# EAGLE design mb2 (EAGLE 7.4.0)
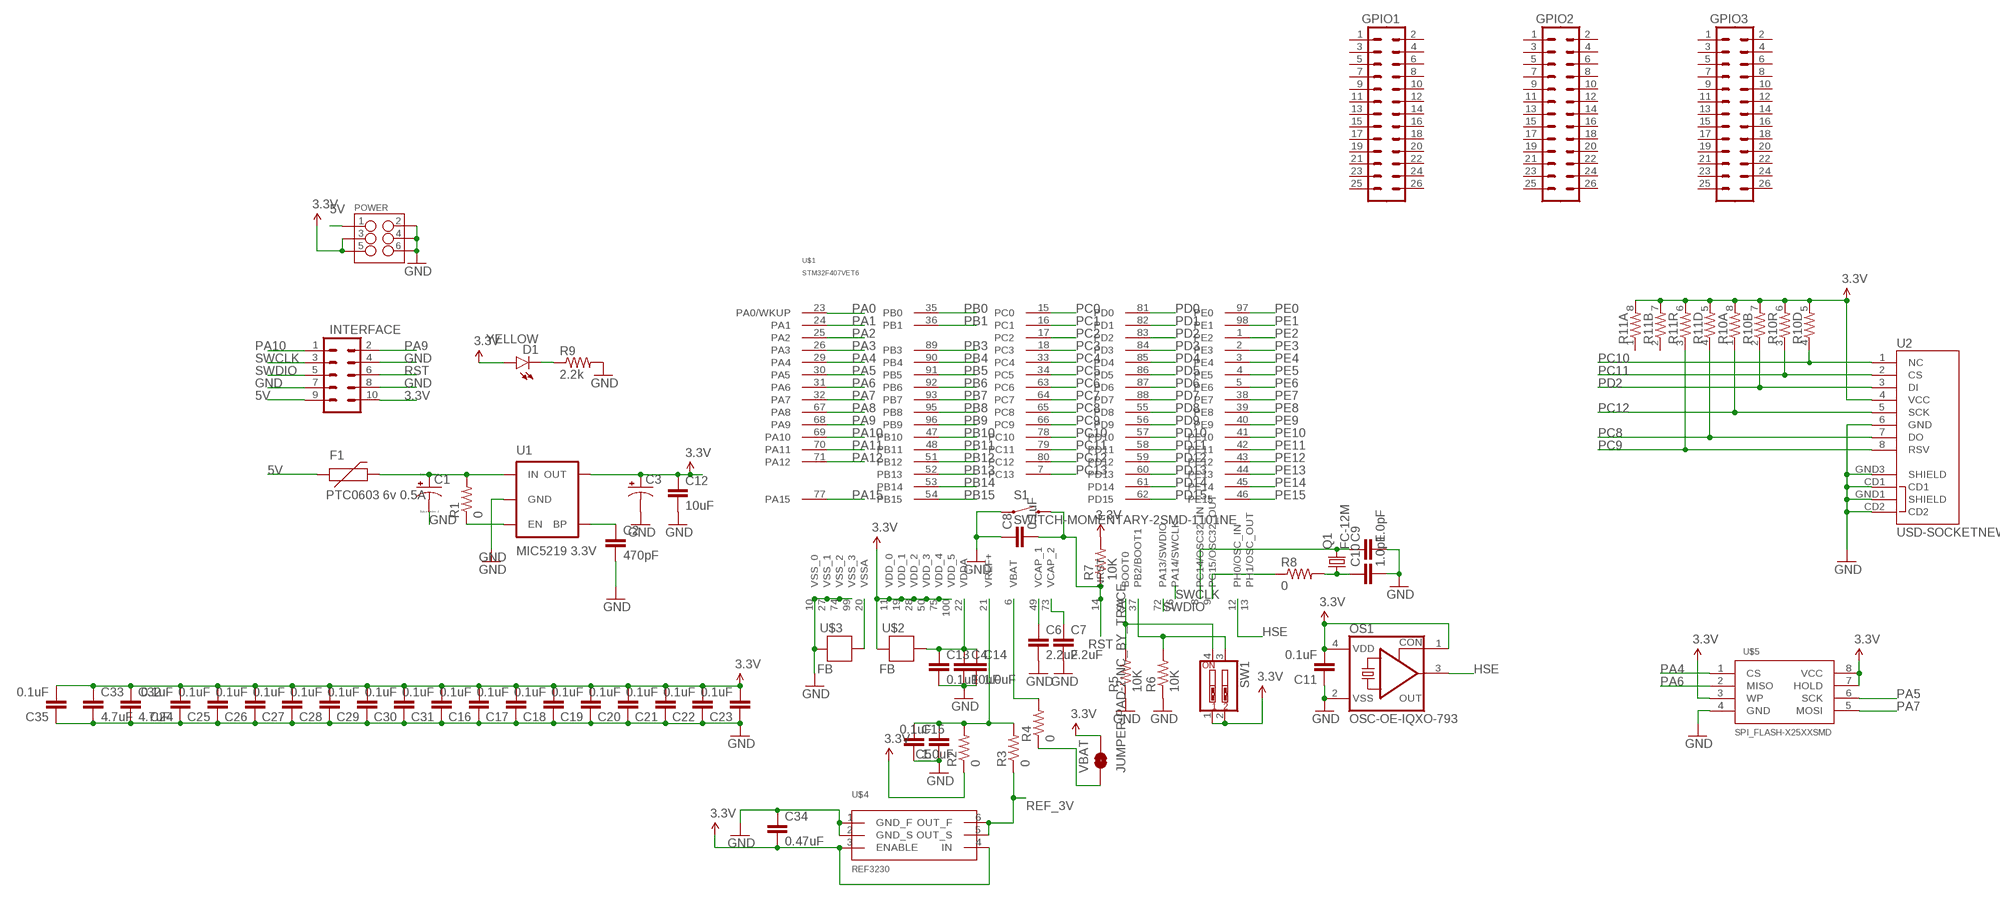
[diagram p0: schematic, sheet 1]

## Parts
C1  CPOL-USB  [PANASONIC_B]
C2  470pF  470PF-50V-5%(0603)SMD  [0603-CAP]
C3  CAP_POL1206  [EIA3216]
C4  10uF  10UF-6.3V-20%(0603)  [0603-CAP]
C5  0.1uF  0.1UF-25V-5%(0603)  [0603-CAP]
C6  2.2uF  2.2UF-10V-20%(0603)  [0603-CAP]
C7  2.2uF  2.2UF-10V-20%(0603)  [0603-CAP]
C8  0.1uF  0.1UF-25V-5%(0603)  [0603-CAP]
C9  1.0pF  1.0PF-50V(-/+.25PF)(0603)  [0603-CAP]
C10  1.0pF  1.0PF-50V(-/+.25PF)(0603)  [0603-CAP]
C11  0.1uF  0.1UF-25V-5%(0603)  [0603-CAP]
C12  10uF  10UF-6.3V-20%(0603)  [0603-CAP]
C13  0.1uF  0.1UF-25V-5%(0603)  [0603-CAP]
C14  1.0uF  1.0UF-16V-10%(0603)  [0603-CAP]
C15  1.0uF  1.0UF-16V-10%(0603)  [0603-CAP]
C16  0.1uF  0.1UF-25V-5%(0603)  [0603-CAP]
C17  0.1uF  0.1UF-25V-5%(0603)  [0603-CAP]
C18  0.1uF  0.1UF-25V-5%(0603)  [0603-CAP]
C19  0.1uF  0.1UF-25V-5%(0603)  [0603-CAP]
C20  0.1uF  0.1UF-25V-5%(0603)  [0603-CAP]
C21  0.1uF  0.1UF-25V-5%(0603)  [0603-CAP]
C22  0.1uF  0.1UF-25V-5%(0603)  [0603-CAP]
C23  0.1uF  0.1UF-25V-5%(0603)  [0603-CAP]
C24  0.1uF  0.1UF-25V-5%(0603)  [0603-CAP]
C25  0.1uF  0.1UF-25V-5%(0603)  [0603-CAP]
C26  0.1uF  0.1UF-25V-5%(0603)  [0603-CAP]
C27  0.1uF  0.1UF-25V-5%(0603)  [0603-CAP]
C28  0.1uF  0.1UF-25V-5%(0603)  [0603-CAP]
C29  0.1uF  0.1UF-25V-5%(0603)  [0603-CAP]
C30  0.1uF  0.1UF-25V-5%(0603)  [0603-CAP]
C31  0.1uF  0.1UF-25V-5%(0603)  [0603-CAP]
C32  4.7uF  4.7UF-6.3V-10%(0603)0603  [0603-CAP]
C33  4.7uF  4.7UF-6.3V-10%(0603)0603  [0603-CAP]
C34  0.47uF  0.1UF-25V-5%(0603)  [0603-CAP]
C35  0.1uF  0.1UF-25V-5%(0603)  [0603-CAP]
D1  YELLOW  LED-YELLOW1206  [LED-1206]
F1  PTC0603 6v 0.5A  PTC0603  [0603]
GPIO1  M13X22X13  [2X13]
GPIO2  M13X22X13  [2X13]
GPIO3  M13X22X13  [2X13]
INTERFACE  M05X2RA  [2X5-RA]
OS1  OSC-OE-IQXO-793  [2.5X2-4-PAD]
POWER  M03X22X3_SILK_MALE_PTH  [2X3]
Q1  FC-12M  [FC-12M]
R1  0  0OHM-1/10W-5%(0603)  [0603]
R2  0  0OHM-1/10W-5%(0603)  [0603]
R3  0  0OHM-1/10W-5%(0603)  [0603]
R4  0  0OHM-1/10W-5%(0603)  [0603]
R5  10K  10KOHM-1/10W-1%(0603)0603  [0603-RES]
R6  10K  10KOHM-1/10W-1%(0603)0603  [0603-RES]
R7  10K  10KOHM-1/10W-1%(0603)0603  [0603-RES]
R8  0  0OHM-1/10W-5%(0603)  [0603]
R9  2.2k  2.2KOHM-1/10W-1%(0603)  [0603-RES]
R10  RESISTOR-ARRAY0603-ARV  [0603-ARV]
R11  RESISTOR-ARRAY0603-ARV  [0603-ARV]
S1  SWITCH-MOMENTARY-2SMD-1101NE  [TACTILE-SWITCH-1101NE]
SW1  SW_DIP-2-SMT-HALFSIZE  [DIPSWITCH-02-50MIL]
U1  MIC5219 3.3V  V_REG_MIC52193.3V  [SOT23-5]
U2  USD-SOCKETNEW  [MICRO-SD-SOCKET-PP]
U$1  STM32F407VET6  [LQFP-100]
U$2  FB  [0603]
U$3  FB  [0603]
U$4  REF3230  [SOT23-6]
U$5  SPI_FLASH-X25XXSMD  [SO08]
VBAT  JUMPER-PAD-2-NC_BY_TRACE  [PAD-JUMPER-2-NC_BY_TRACE_YES_SILK]

## Nets
3.3V: C3.A(+) C11.2 C12.1 C16.2 C17.2 C18.2 C19.2 C20.2 C21.2 C22.2 C23.2 C24.2 C25.2 C26.2 C27.2 C28.2 C29.2 C30.2 C31.2 C32.1 C33.1 C34.2 C35.2 D1.A INTERFACE.10 OS1.1(CON) OS1.4(VDD) POWER.3 POWER.5 R2.1 R7.2 R10.5 R10.6 R10.7 R10.8 R11.5 R11.6 R11.7 R11.8 SW1.1 SW1.2 U1.5(OUT) U2.4(VCC) U$1.11(VDD_0) U$1.19(VDD_1) U$1.28(VDD_2) U$1.50(VDD_3) U$1.75(VDD_4) U$1.100(VDD_5) U$2.2 U$4.3(ENABLE) U$4.4(IN) U$5.3(WP) U$5.7(HOLD) U$5.8(VCC) VBAT.2
5V: F1.1 INTERFACE.9 POWER.1
GND: C1.- C2.2 C3.C(-) C4.2 C5.1 C6.2 C7.2 C8.1 C9.2 C10.2 C11.1 C12.2 C13.2 C14.2 C15.2 C16.1 C17.1 C18.1 C19.1 C20.1 C21.1 C22.1 C23.1 C24.1 C25.1 C26.1 C27.1 C28.1 C29.1 C30.1 C31.1 C32.2 C33.2 C34.1 C35.1 INTERFACE.4 INTERFACE.7 INTERFACE.8 OS1.2(VSS) POWER.2 POWER.4 POWER.6 R5.1 R6.1 R9.2 S1.1 U1.2(GND) U2.6(GND) U2.CD1 U2.CD2 U2.GND1(SHIELD) U2.GND3(SHIELD) U$1.10(VSS_0) U$1.27(VSS_1) U$1.74(VSS_2) U$1.99(VSS_3) U$3.2 U$4.1(GND_F) U$4.2(GND_S) U$5.4(GND)
HSE: OS1.3(OUT) U$1.12(PH0/OSC_IN)
N$1: C1.+ F1.2 R1.2 U1.1(IN)
N$2: R1.1 U1.3(EN)
N$3: C2.1 U1.4(BP)
N$4: U$1.20(VSSA) U$3.1
N$5: R4.1 VBAT.1
N$6: C4.1 C13.1 C14.1 U$1.22(VDDA) U$2.1
N$7: C5.2 C15.1 R2.2 R3.2 U$1.21(VREF+)
N$8: C6.1 U$1.49(VCAP_1)
N$9: C7.1 U$1.73(VCAP_2)
N$10: R4.2 U$1.6(VBAT)
N$11: R5.2 SW1.4 U$1.94(BOOT0)
N$12: R6.2 SW1.3 U$1.37(PB2/BOOT1)
N$13: R8.1 U$1.9(PC15/OSC32_OUT)
N$14: C10.1 Q1.1 R8.2
N$15: C9.1 Q1.2 U$1.8(PC14/OSC32_IN)
N$16: D1.C R9.1
PA0: U$1.23(PA0/WKUP)
PA1: U$1.24(PA1)
PA2: U$1.25(PA2)
PA3: U$1.26(PA3)
PA4: U$1.29(PA4) U$5.1(CS)
PA5: U$1.30(PA5) U$5.6(SCK)
PA6: U$1.31(PA6) U$5.2(MISO)
PA7: U$1.32(PA7) U$5.5(MOSI)
PA8: U$1.67(PA8)
PA9: INTERFACE.2 U$1.68(PA9)
PA10: INTERFACE.1 U$1.69(PA10)
PA11: U$1.70(PA11)
PA12: U$1.71(PA12)
PA15: U$1.77(PA15)
PB0: U$1.35(PB0)
PB1: U$1.36(PB1)
PB3: U$1.89(PB3)
PB4: U$1.90(PB4)
PB5: U$1.91(PB5)
PB6: U$1.92(PB6)
PB7: U$1.93(PB7)
PB8: U$1.95(PB8)
PB9: U$1.96(PB9)
PB10: U$1.47(PB10)
PB11: U$1.48(PB11)
PB12: U$1.51(PB12)
PB13: U$1.52(PB13)
PB14: U$1.53(PB14)
PB15: U$1.54(PB15)
PC0: U$1.15(PC0)
PC1: U$1.16(PC1)
PC2: U$1.17(PC2)
PC3: U$1.18(PC3)
PC4: U$1.33(PC4)
PC5: U$1.34(PC5)
PC6: U$1.63(PC6)
PC7: U$1.64(PC7)
PC8: R11.4 U2.7(DO) U$1.65(PC8)
PC9: R11.3 U2.8(RSV) U$1.66(PC9)
PC10: R10.4 U2.1(NC) U$1.78(PC10)
PC11: R10.3 U2.2(CS) U$1.79(PC11)
PC12: R10.1 U2.5(SCK) U$1.80(PC12)
PC13: U$1.7(PC13)
PD0: U$1.81(PD0)
PD1: U$1.82(PD1)
PD2: R10.2 U2.3(DI) U$1.83(PD2)
PD3: U$1.84(PD3)
PD4: U$1.85(PD4)
PD5: U$1.86(PD5)
PD6: U$1.87(PD6)
PD7: U$1.88(PD7)
PD8: U$1.55(PD8)
PD9: U$1.56(PD9)
PD10: U$1.57(PD10)
PD11: U$1.58(PD11)
PD12: U$1.59(PD12)
PD13: U$1.60(PD13)
PD14: U$1.61(PD14)
PD15: U$1.62(PD15)
PE0: U$1.97(PE0)
PE1: U$1.98(PE1)
PE2: U$1.1(PE2)
PE3: U$1.2(PE3)
PE4: U$1.3(PE4)
PE5: U$1.4(PE5)
PE6: U$1.5(PE6)
PE7: U$1.38(PE7)
PE8: U$1.39(PE8)
PE9: U$1.40(PE9)
PE10: U$1.41(PE10)
PE11: U$1.42(PE11)
PE12: U$1.43(PE12)
PE13: U$1.44(PE13)
PE14: U$1.45(PE14)
PE15: U$1.46(PE15)
REF_3V: R3.1 U$4.5(OUT_S) U$4.6(OUT_F)
RST: C8.2 INTERFACE.6 R7.1 S1.2 U$1.14(NRST)
SWCLK: INTERFACE.3 U$1.76(PA14/SWCLK)
SWDIO: INTERFACE.5 U$1.72(PA13/SWDIO)
Unconnected: GPIO1.1 GPIO1.2 GPIO1.3 GPIO1.4 GPIO1.5 GPIO1.6 GPIO1.7 GPIO1.8 GPIO1.9 GPIO1.10 GPIO1.11 GPIO1.12 GPIO1.13 GPIO1.14 GPIO1.15 GPIO1.16 GPIO1.17 GPIO1.18 GPIO1.19 GPIO1.20 GPIO1.21 GPIO1.22 GPIO1.23 GPIO1.24 GPIO1.25 GPIO1.26 GPIO2.1 GPIO2.2 GPIO2.3 GPIO2.4 GPIO2.5 GPIO2.6 GPIO2.7 GPIO2.8 GPIO2.9 GPIO2.10 GPIO2.11 GPIO2.12 GPIO2.13 GPIO2.14 GPIO2.15 GPIO2.16 GPIO2.17 GPIO2.18 GPIO2.19 GPIO2.20 GPIO2.21 GPIO2.22 GPIO2.23 GPIO2.24 GPIO2.25 GPIO2.26 GPIO3.1 GPIO3.2 GPIO3.3 GPIO3.4 GPIO3.5 GPIO3.6 GPIO3.7 GPIO3.8 GPIO3.9 GPIO3.10 GPIO3.11 GPIO3.12 GPIO3.13 GPIO3.14 GPIO3.15 GPIO3.16 GPIO3.17 GPIO3.18 GPIO3.19 GPIO3.20 GPIO3.21 GPIO3.22 GPIO3.23 GPIO3.24 GPIO3.25 GPIO3.26 R11.1 R11.2 U$1.13(PH1/OSC_OUT)

## Library data of the parts
C1 = resistor:CPOL-US: POLARIZED CAPACITOR, American symbol
C2 = SparkFun-Capacitors:470PF-50V-5%(0603): CAP-07884; PROD_ID: CAP-07884
C3 = SparkFun-Capacitors:CAP_POL: Capacitor Polarized These are standard SMD and PTH capacitors. Normally 10uF, 47uF, and 100uF in electrolytic and tantalum varieties. Always verify the external diameter of the through hole cap, it varies with capacity, voltage, and manufacturer. The EIA devices should be standard.
C4 C12 = SparkFun-Capacitors:10UF-6.3V-20%(0603): CAP-11015; PROD_ID: CAP-11015
C5 C8 C11 C13 C16-C31 C35 = SparkFun-Capacitors:0.1UF-25V-5%(0603): CAP-08604; PROD_ID: CAP-08604
C6 C7 = SparkFun-Capacitors:2.2UF-10V-20%(0603): CAP-07888; PROD_ID: CAP-07888
C9 C10 = SparkFun-Capacitors:1.0PF-50V(-/+.25PF)(0603): CAP-07879; PROD_ID: CAP-07879
C14 C15 = SparkFun-Capacitors:1.0UF-16V-10%(0603): CAP-00868; PROD_ID: CAP-00868
C32 C33 = SparkFun-Capacitors:4.7UF-6.3V-10%(0603): CAP-08280; PROD_ID: CAP-08280
C34 = SparkFun-Capacitors:0.1UF-25V-5%(0603): CAP-08604; PROD_ID: CAP-08604; VALUE: 0.1uF
D1 = SparkFun-LED:LED-YELLOW: Yellow SMD LEDs LilyPad 1206- DIO-09909 0603- DIO-09003 "SMART" means more efficient and expensive; PROD_ID: DIO-00820
F1 = SparkFun-PowerIC:PTC: Resettable Fuse PTC Resettable Fuse. Spark Fun Electronics SKU : COM-08357
GPIO1-GPIO3 = SparkFun-Connectors:M13X2: 0.1" spaced headers
INTERFACE = SparkFun-Connectors:M05X2: Header 5x2 Standard 10-pin dual row 0.1" header. Commonly used with AVR-ISP. Use with Spark Fun Electronics SKU: PRT-00778
OS1 = IQD-Frequency-Products:OSC-OE: OSCILLATOR WITH OE
POWER = SparkFun-Connectors:M03X2: 2x3 .1" header. Shrouded, with keying- CONN-10681 SMT- CONN-11415 Pogo pins- HW-11044; PROD_ID: CONN-09701
Q1 = crystal:FC-12M: kHz RANGE CRYSTAL UNIT LOW PROFILE SMD Source: Epson Toyocom FC-12M.pdf
R1-R4 R8 = SparkFun-Resistors:0OHM-1/10W-5%(0603): RES-08609; PROD_ID: RES-08609
R5-R7 = SparkFun-Resistors:10KOHM-1/10W-1%(0603): RES-00824; PROD_ID: RES-00824
R9 = SparkFun-Resistors:2.2KOHM-1/10W-1%(0603): RES-08272; PROD_ID: RES-08272
R10 R11 = SparkFun-Resistors:RESISTOR-ARRAY: Array Chip Resistor Source: RS Component / Phycomp
S1 = SparkFun-Electromechanical:SWITCH-MOMENTARY-2: Various NO switches- pushbuttons, reed, etc; PROD_ID: SWCH-00815
SW1 = SparkFun-Electromechanical:SW_DIP-2: DIP SWITCH
U1 = SparkFun-PowerIC:V_REG_MIC5219: V_REG MIC5219 Standard 3.3V and 5V 500mA LDO voltage regulator in SOT-23 layout. Micrel part MIC5219. BP (by-pass) pin is used to lower output noise with 470pF cap, may be left open.; PROD_ID: VREG-09872
U2 = SparkFun-Connectors:USD-SOCKET: microSD Socket Push-push type uSD socket. Schematic element and footprint production proven. Spark Fun Electronics SKU : PRT-00127. tDoc lines correctly indicate media card edge positions when inserting (unlocked, locked, depressed). NOTE: CD1 and CD2 are connected internally; PROD_ID: CONN-07820
U$1 = r1:STM32F407VET6
U$2 U$3 = SparkFun-Passives:FB
U$4 = SparkFun-AnalogIC:REF3230
U$5 = SparkFun-DigitalIC:SPI_FLASH-X25XX: 8pin SPI Flash series x25xx. Works with devices like W25X32 and BR25L32
VBAT = SparkFun-Passives:JUMPER-PAD-2-NC_BY_TRACE

## Board
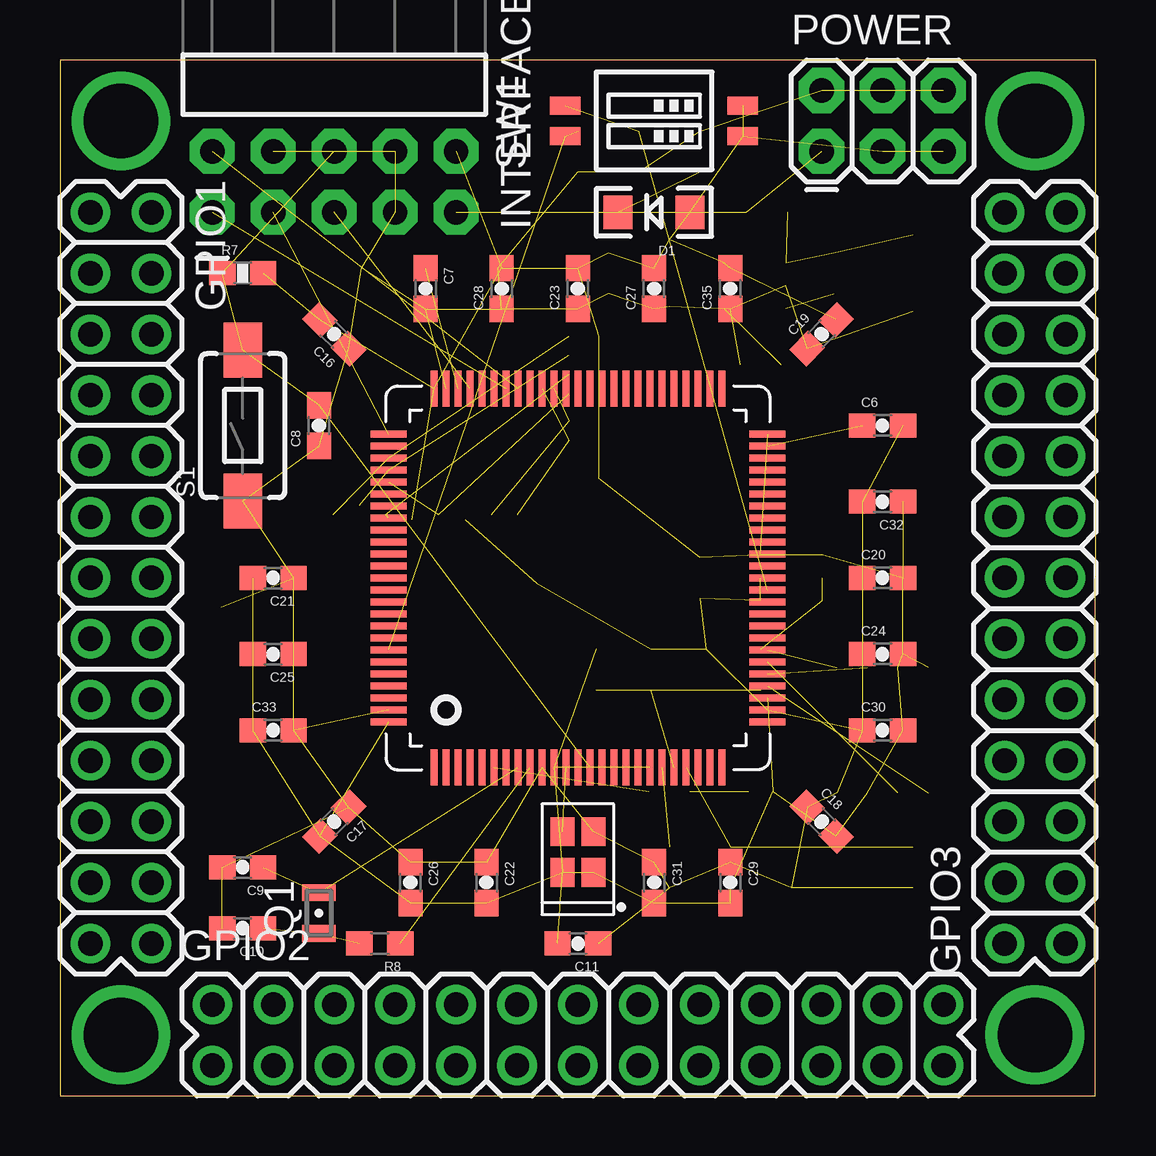
[diagram p1: board, top side]
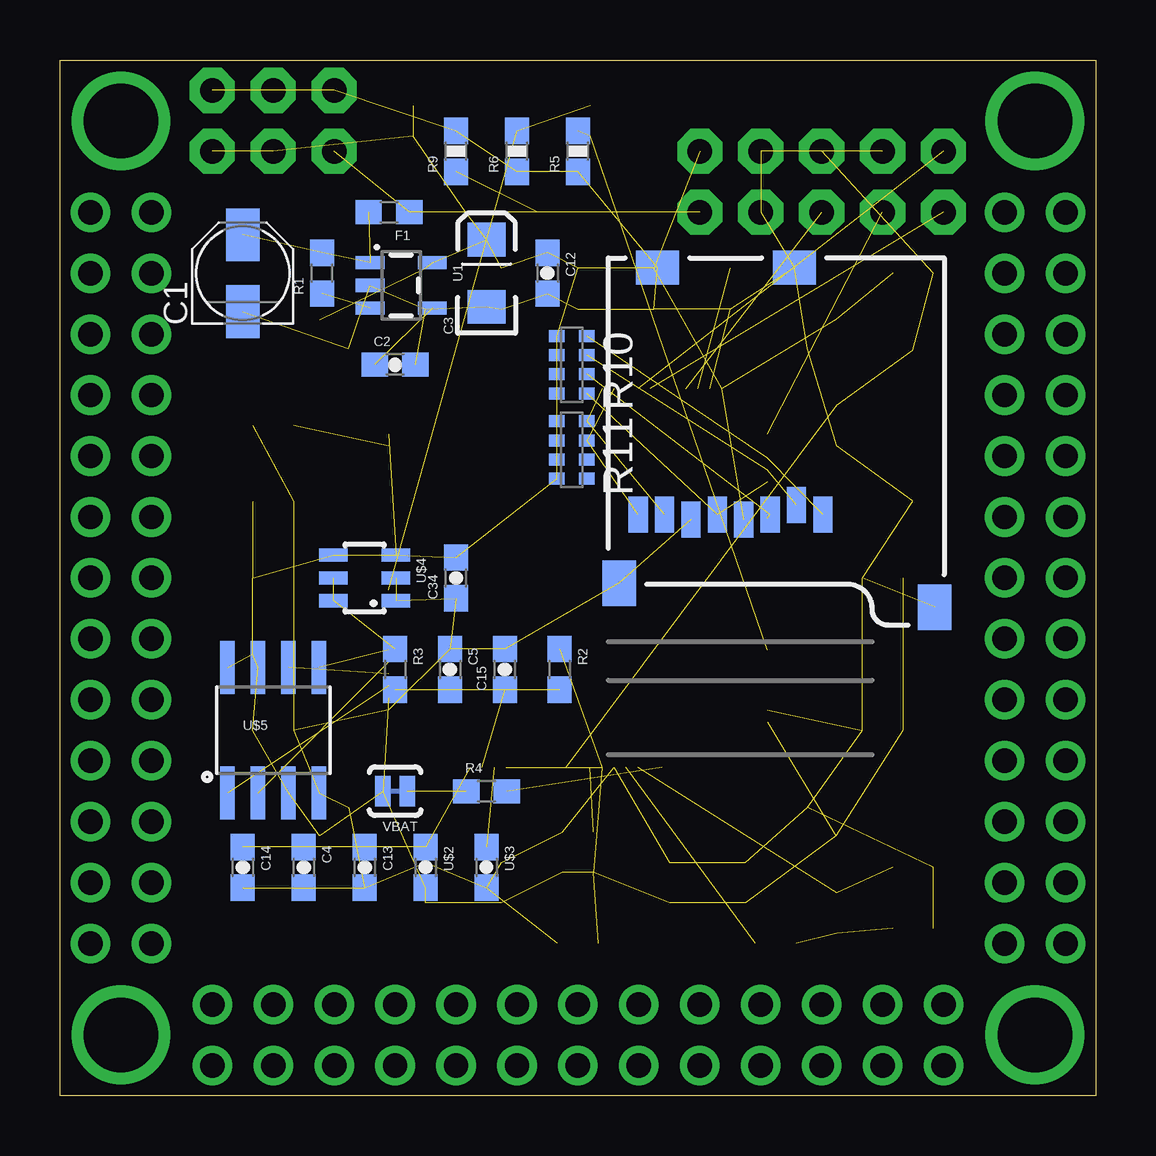
[diagram p2: board, bottom side, seen from below]

Size 43.18 x 43.18 mm. Coordinates in mm from the lower left corner, seen from the top.
Outline: 0,0 43.16,0 43.18,43.18 0,43.18 0,0
Copper layers [2:(1+(2*15)+16):15]: Top 0.035mm / dielectric 1.5mm / Route2 0.035mm / dielectric 0.15mm / Route15 0.035mm / dielectric 0.2mm / Bottom 0.035mm
Design rules "default *": minimum track width 10mil, minimum drill 24mil, track to track 8mil, track to pad 8mil, pad to pad 8mil, via to via 8mil, smd to smd 8mil, copper to edge 40mil, drill to drill 8mil, minimum pad ring 10mil, minimum via ring 8mil, stop-mask expansion 4mil, vias tented up to drill 0mil, thermal gap 10mil

### Footprints (pad centres in the part's own frame; a part is rotated, then mirrored left to right if it is on the bottom)
PANASONIC_B = smd 2.2 x 1.4: + 1.6,0; - -1.6,0
0603-CAP = smd 1.1 x 1: 1 -0.85,0; 2 0.85,0
EIA3216 = smd 1.4 x 1.6: A 1.4,0; C -1.4,0
LED-1206 = smd 1.2 x 1.4: A -1.5,0; C 1.5,0
0603 = smd 1.1 x 1: 1 -0.85,0; 2 0.85,0
2X13 = drill 1.016 pad 1.651: 1 0,0; 2 0,2.54; 3 2.54,0; 4 2.54,2.54; 5 5.08,0; 6 5.08,2.54; 7 7.62,0; 8 7.62,2.54; 9 10.16,0; 10 10.16,2.54; 11 12.7,0; 12 12.7,2.54; 13 15.24,0; 14 15.24,2.54; 15 17.78,0; 16 17.78,2.54; 17 20.32,0; 18 20.32,2.54; 19 22.86,0; 20 22.86,2.54; 21 25.4,0; 22 25.4,2.54; 23 27.94,0; 24 27.94,2.54; 25 30.48,0; 26 30.48,2.54
2X5-RA = drill 1.016 pad 1.88 octagon: 1 -1.27,5.08; 2 1.27,5.08; 3 -1.27,2.54; 4 1.27,2.54; 5 -1.27,0; 6 1.27,0; 7 -1.27,-2.54; 8 1.27,-2.54; 9 -1.27,-5.08; 10 1.27,-5.08
2.5X2-4-PAD = smd 1.2 x 1: 1 -0.85,-0.65; 2 0.85,-0.65; 3 0.85,0.65; 4 -0.85,0.65
2X3 = drill 1.016 pad 1.88 octagon: 1 0,0; 2 0,2.54; 3 2.54,0; 4 2.54,2.54; 5 5.08,0; 6 5.08,2.54
FC-12M = smd 0.7 x 1.4: 1 -0.85,0; 2 0.85,0
0603-RES = smd 1.1 x 1: 1 -0.85,0; 2 0.85,0
0603-ARV = smd 0.5 x 0.65: 1 -1.2,-0.625; 2 -0.4,-0.625; 3 0.4,-0.625; 4 1.2,-0.625; 5 1.2,0.625; 6 0.4,0.625; 7 -0.4,0.625; 8 -1.2,0.625
TACTILE-SWITCH-1101NE = smd 2.3 x 1.6: 1 -3.15,0; 2 3.15,0
DIPSWITCH-02-50MIL = smd 0.762 x 1.27: 1 -0.635,-3.7; 2 0.635,-3.7; 3 0.635,3.7; 4 -0.635,3.7
SOT23-5 = smd 0.55 x 1.2: 1 -0.95,-1.3; 2 0,-1.3; 3 0.95,-1.3; 4 0.95,1.3; 5 -0.95,1.3
MICRO-SD-SOCKET-PP = smd 0.8 x 1.5: 1 -8.94,10.7; 2 -7.84,10.3; 3 -6.74,10.7; 4 -5.64,10.9; 5 -4.54,10.7; 6 -3.44,10.9; 7 -2.34,10.7; 8 -1.24,10.7 | smd 1.8 x 1.4: CD1 -2.05,0.4; CD2 -7.75,0.4 | smd 1.4 x 1.9: GND1 -13.6,14.55; GND3 -0.45,13.55
LQFP-100 = smd 0.3 x 1.5: 1 -6,-7.9; 2 -5.5,-7.9; 3 -5,-7.9; 4 -4.5,-7.9; 5 -4,-7.9; 6 -3.5,-7.9; 7 -3,-7.9; 8 -2.5,-7.9; 9 -2,-7.9; 10 -1.5,-7.9; 11 -1,-7.9; 12 -0.5,-7.9; 13 0,-7.9; 14 0.5,-7.9; 15 1,-7.9; 16 1.5,-7.9; 17 2,-7.9; 18 2.5,-7.9; 19 3,-7.9; 20 3.5,-7.9; 21 4,-7.9; 22 4.5,-7.9; 23 5,-7.9; 24 5.5,-7.9; 25 6,-7.9; 51 6,7.9; 52 5.5,7.9; 53 5,7.9; 54 4.5,7.9; 55 4,7.9; 56 3.5,7.9; 57 3,7.9; 58 2.5,7.9; 59 2,7.9; 60 1.5,7.9; 61 1,7.9; 62 0.5,7.9; 63 0,7.9; 64 -0.5,7.9; 65 -1,7.9; 66 -1.5,7.9; 67 -2,7.9; 68 -2.5,7.9; 69 -3,7.9; 70 -3.5,7.9; 71 -4,7.9; 72 -4.5,7.9; 73 -5,7.9; 74 -5.5,7.9; 75 -6,7.9 | smd 1.5 x 0.3: 26 7.9,-6; 27 7.9,-5.5; 28 7.9,-5; 29 7.9,-4.5; 30 7.9,-4; 31 7.9,-3.5; 32 7.9,-3; 33 7.9,-2.5; 34 7.9,-2; 35 7.9,-1.5; 36 7.9,-1; 37 7.9,-0.5; 38 7.9,0; 39 7.9,0.5; 40 7.9,1; 41 7.9,1.5; 42 7.9,2; 43 7.9,2.5; 44 7.9,3; 45 7.9,3.5; 46 7.9,4; 47 7.9,4.5; 48 7.9,5; 49 7.9,5.5; 50 7.9,6; 76 -7.9,6; 77 -7.9,5.5; 78 -7.9,5; 79 -7.9,4.5; 80 -7.9,4; 81 -7.9,3.5; 82 -7.9,3; 83 -7.9,2.5; 84 -7.9,2; 85 -7.9,1.5; 86 -7.9,1; 87 -7.9,0.5; 88 -7.9,0; 89 -7.9,-0.5; 90 -7.9,-1; 91 -7.9,-1.5; 92 -7.9,-2; 93 -7.9,-2.5; 94 -7.9,-3; 95 -7.9,-3.5; 96 -7.9,-4; 97 -7.9,-4.5; 98 -7.9,-5; 99 -7.9,-5.5; 100 -7.9,-6
SOT23-6 = smd 0.55 x 1.2: 1 0.95,1.3; 2 0,1.3; 3 -0.95,1.3; 4 -0.95,-1.3; 5 0,-1.3; 6 0.95,-1.3
SO08 = smd 0.61 x 2.21: 1 -1.905,-2.616; 2 -0.635,-2.616; 3 0.635,-2.616; 4 1.905,-2.616; 5 1.905,2.616; 6 0.635,2.616; 7 -0.635,2.616; 8 -1.905,2.616
PAD-JUMPER-2-NC_BY_TRACE_YES_SILK = smd 0.635 x 1.27: 1 -0.508,0; 2 0.508,0

### Placement (x,y rotation side)
C1  35.56,34.29 90 bottom
C2  29.21,30.48 0 bottom
C3  25.4,34.29 90 bottom
C4  33.02,9.53 270 bottom
C5  26.92,17.78 270 bottom
C6  34.29,27.94 0 top
C7  15.24,33.66 270 top
C8  10.79,27.94 90 top
C9  7.62,9.53 180 top
C10  7.62,6.99 180 top
C11  21.59,6.35 180 top
C12  22.86,34.29 270 bottom
C13  30.48,9.53 270 bottom
C14  35.56,9.53 270 bottom
C15  24.64,17.78 90 bottom
C16  11.43,31.75 135 top
C17  11.43,11.43 225 top
C18  31.75,11.43 315 top
C19  31.75,31.75 45 top
C20  34.29,21.59 0 top
C21  8.89,21.59 180 top
C22  17.78,8.89 270 top
C23  21.59,33.66 90 top
C24  34.29,18.41 0 top
C25  8.89,18.41 180 top
C26  14.61,8.89 270 top
C27  24.77,33.66 90 top
C28  18.41,33.66 90 top
C29  27.94,8.89 270 top
C30  34.29,15.24 0 top
C31  24.77,8.89 270 top
C32  34.29,24.77 180 top
C33  8.89,15.24 0 top
C34  26.67,21.59 90 bottom
C35  27.94,33.66 90 top
D1  24.77,36.83 180 top
F1  29.46,36.83 180 bottom
GPIO1  1.27,36.83 270 top
GPIO2  6.35,1.27 0 top
GPIO3  41.91,6.35 90 top
INTERFACE  11.43,38.1 90 top
OS1  21.59,10.16 90 top
POWER  31.75,39.37 0 top
Q1  10.79,7.62 90 top
R1  32.26,34.29 90 bottom
R2  22.35,17.78 270 bottom
R3  29.21,17.78 270 bottom
R4  25.4,12.7 0 bottom
R5  21.59,39.37 90 bottom
R6  24.13,39.37 90 bottom
R7  7.62,34.29 0 top
R8  13.34,6.35 180 top
R9  26.67,39.37 90 bottom
R10  21.84,30.48 90 bottom
R11  21.84,26.92 90 bottom
S1  7.62,27.94 90 top
SW1  24.77,40.64 90 top
U1  28.96,33.78 270 bottom
U2  20.32,34.92 180 bottom
U$1  21.59,21.59 0 top
U$2  27.94,9.53 270 bottom
U$3  25.4,9.53 270 bottom
U$4  30.48,21.59 270 bottom
U$5  34.29,15.24 0 bottom
VBAT  29.21,12.7 180 bottom

### Tracks (layer width: path | path; a pad name or v marks a point on that pad's centre or on a via)
3.3V  (55 unrouted)
5V  (2 unrouted)
GND  (59 unrouted)
HSE  (1 unrouted)
N$1  (3 unrouted)
N$2  (1 unrouted)
N$3  (1 unrouted)
N$4  (1 unrouted)
N$5  (1 unrouted)
N$6  (4 unrouted)
N$7  (4 unrouted)
N$8  (1 unrouted)
N$9  (1 unrouted)
N$10  (1 unrouted)
N$11  (2 unrouted)
N$12  (2 unrouted)
N$13  (1 unrouted)
N$14  (2 unrouted)
N$15  (2 unrouted)
N$16  (1 unrouted)
N$17  (via drill 3.1)
  other vias: 2.54,40.64
N$18  (via drill 3.1)
  other vias: 2.54,2.54
N$19  (via drill 3.1)
  other vias: 40.64,2.54
N$20  (via drill 3.1)
  other vias: 40.64,40.64
PA4  (1 unrouted)
PA5  (1 unrouted)
PA6  (1 unrouted)
PA7  (1 unrouted)
PA9  (1 unrouted)
PA10  (1 unrouted)
PC8  (2 unrouted)
PC9  (2 unrouted)
PC10  (2 unrouted)
PC11  (2 unrouted)
PC12  (2 unrouted)
PD2  (2 unrouted)
REF_3V  (2 unrouted)
RST  (4 unrouted)
SWCLK  (1 unrouted)
SWDIO  (1 unrouted)